# Altium schematic sheet Stepper_Driver_Quark.SchDoc: RP2040 CNC
size B; Author: AM; CompanyName: Expatria Technologies; DrawnBy: A.Marles; Engineer: AM; Organization: Expatria Technolgoies; Address1: 1136 Glade Court; Address3: Port Coquitlam, BC V3B 1R5; Address4: Canada; DocumentNumber: 12; SheetNumber: 12; SheetTotal: 30
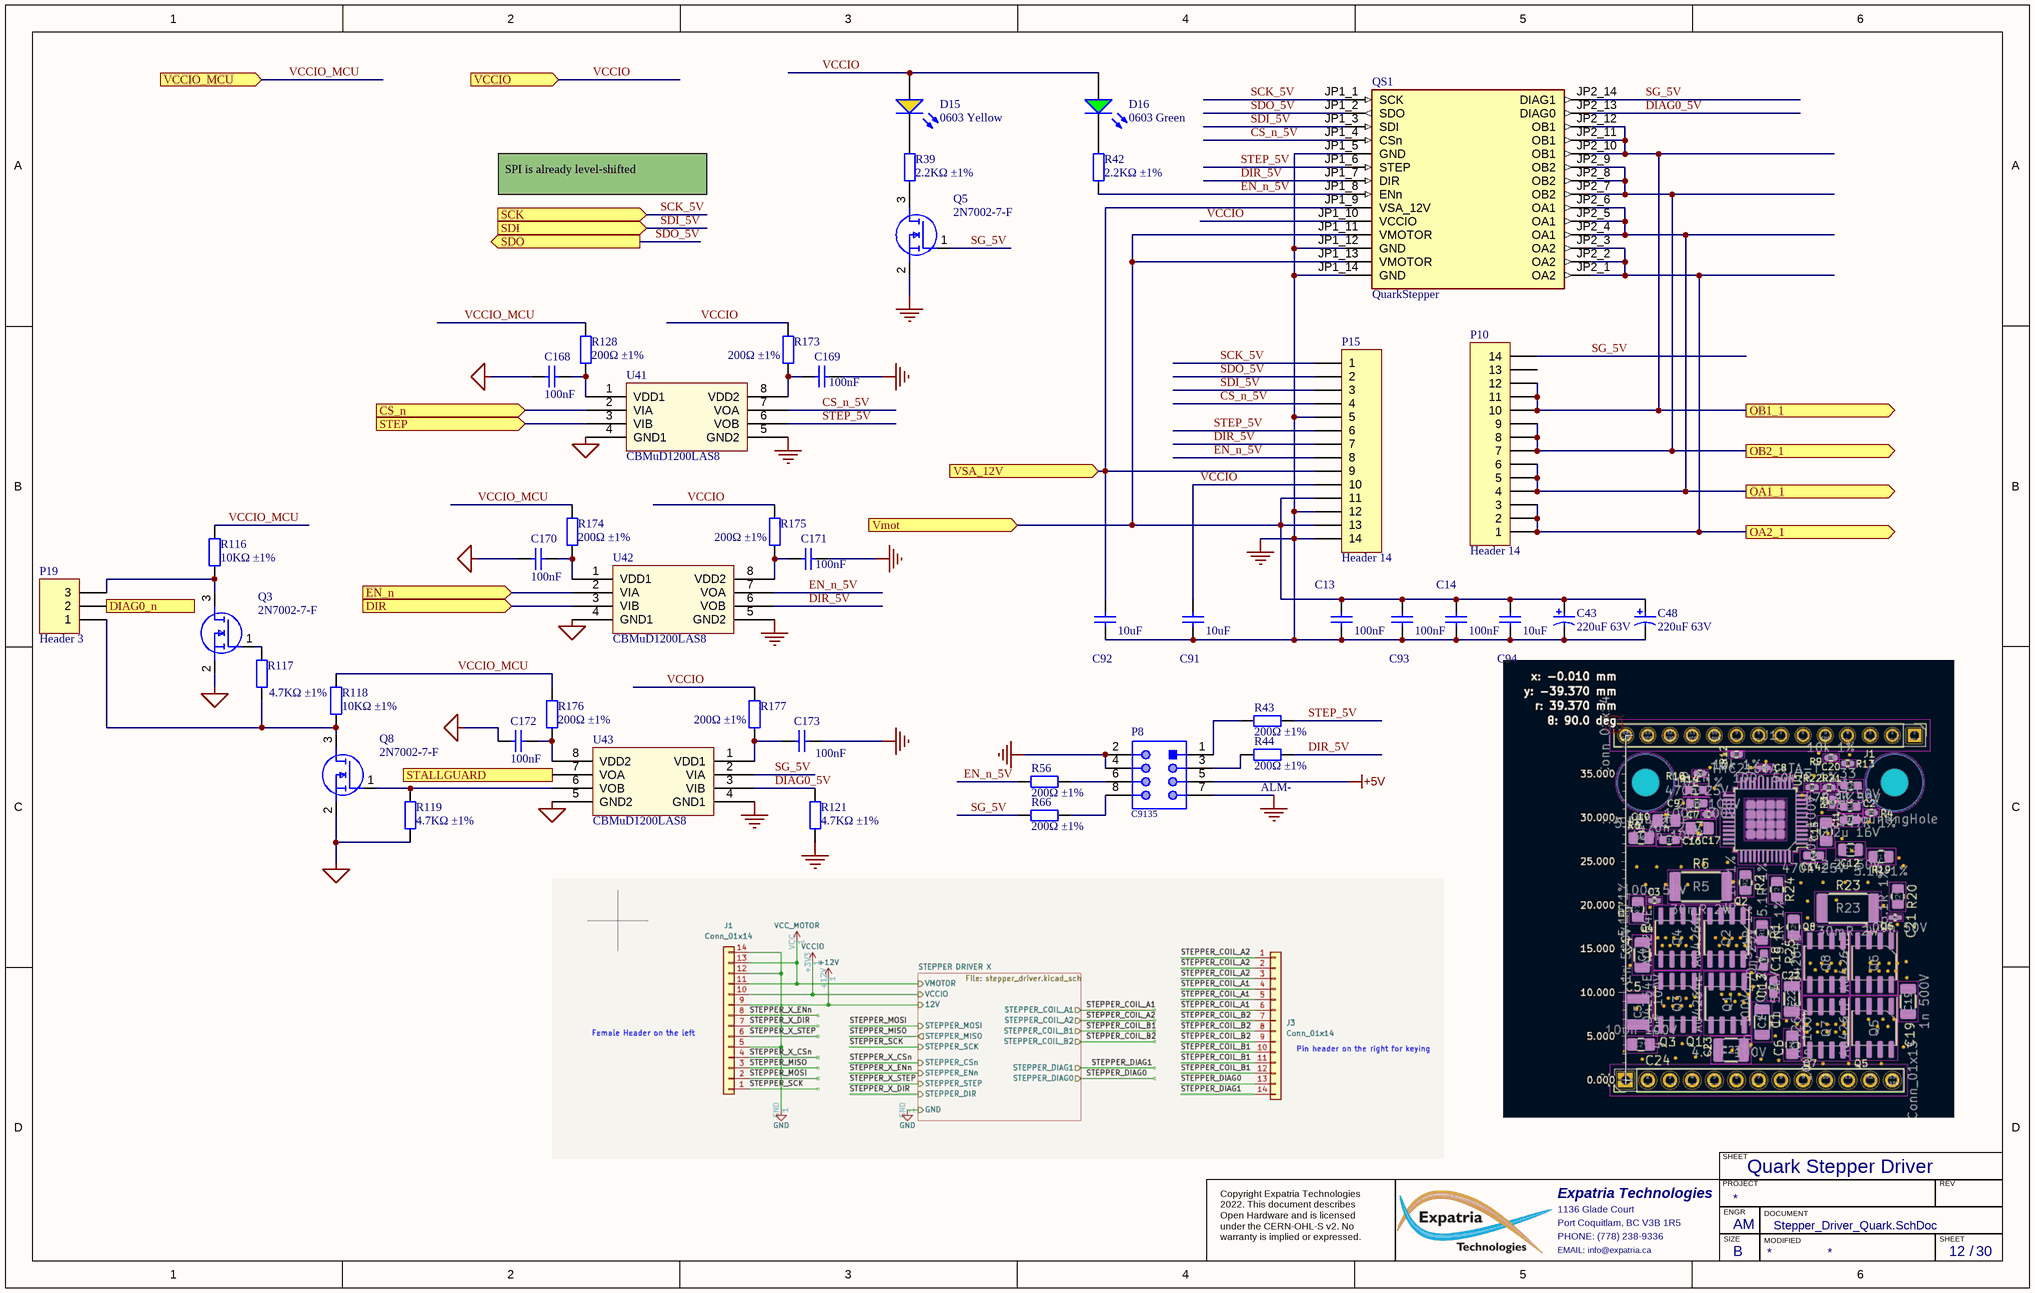
[diagram p0: Stepper_Driver_Quark.SchDoc]

## Parts
C13  100nF  [0603_C]
C14  100nF  [0603_C]
C43  220uF 63V  [PNSC-FK-V-H13_V]
C48  220uF 63V  [PNSC-FK-V-H13_V]
C91  10uF  [0805_C]
C92  10uF  [0805_C]
C93  100nF  [0603_C]
C94  10uF  [0805_C]
C168  100nF  [0603_C]
C169  100nF  [0603_C]
C170  100nF  [0603_C]
C171  100nF  [0603_C]
C172  100nF  [0603_C]
C173  100nF  [0603_C]
D15  0603 Yellow  [0603_LED_S1]
D16  0603 Green  [0603_LED_S1]
P8  C9135  [61200821621]
P10  Header 14  [HDR1X14]
P15  Header 14  [HDR1X14]
P19  Header 3  [HDR1X3]
Q3  2N7002-7-F  [SOT-23(SOT-23-3)]
Q5  2N7002-7-F  [SOT-23(SOT-23-3)]
Q8  2N7002-7-F  [SOT-23(SOT-23-3)]
QS1  QuarkStepper  [QuarkStepperDriver]
R39  2.2KΩ ±1%  [0603_R]
R42  2.2KΩ ±1%  [0603_R]
R43  200Ω ±1%  [0603_R]
R44  200Ω ±1%  [0603_R]
R56  200Ω ±1%  [0603_R]
R66  200Ω ±1%  [0603_R]
R116  10KΩ ±1%  [0603_R]
R117  4.7KΩ ±1%  [0603_R]
R118  10KΩ ±1%  [0603_R]
R119  4.7KΩ ±1%  [0603_R]
R121  4.7KΩ ±1%  [0603_R]
R128  200Ω ±1%  [0603_R]
R173  200Ω ±1%  [0603_R]
R174  200Ω ±1%  [0603_R]
R175  200Ω ±1%  [0603_R]
R176  200Ω ±1%  [0603_R]
R177  200Ω ±1%  [0603_R]
U41  CBMuD1200LAS8  [SOIC-8_150mil]
U42  CBMuD1200LAS8  [SOIC-8_150mil]
U43  CBMuD1200LAS8  [SOIC-8_150mil]

## Ports
CS_n (in), DIAG0_n (out), DIR (in), EN_n (in), OA1_1 (out), OA2_1 (out), OB1_1 (out), OB2_1 (out), SCK (in), SDI (in), SDO (out), STALLGUARD (out), STEP (in), VCCIO (in), VCCIO_MCU (in), Vmot (in), VSA_12V (in)

## Nets
+5V: P8.5
GND: C13.2 C14.2 C43.2 C48.2 C91.1 C92.1 C93.2 C94.1 C169.1 C171.1 C173.2 P8.2 P8.4 P8.7 P15.5 P15.12 P15.14 Q5.2(S) QS1.JP1_5(GND) QS1.JP1_12(GND) QS1.JP1_14(GND) R121.1 U41.5(GND2) U42.5(GND2) U43.4(GND1)
MCU_GND: C168.2 C170.2 C172.1 Q3.2(S) Q8.2(S) R119.1 U41.4(GND1) U42.4(GND1) U43.5(GND2)
CS_n: U41.2(VIA) ; port CS_n
CS_n_5V: P15.4 QS1.JP1_4(CSn) U41.7(VOA)
DIAG0_5V: QS1.JP2_13(DIAG0) R121.2 U43.3(VIB)
DIAG0_n: P19.2 ; port DIAG0_n
DIR: U42.3(VIB) ; port DIR
DIR_5V: P15.7 QS1.JP1_7(DIR) R44.1 U42.6(VOB)
EN_n: U42.2(VIA) ; port EN_n
EN_n_5V: P15.8 QS1.JP1_8(ENn) R42.1 R56.2 U42.7(VOA)
OA1_1: P10.4 P10.5 P10.6 QS1.JP2_4(OA1) QS1.JP2_5(OA1) QS1.JP2_6(OA1) ; port OA1_1
OA2_1: P10.1 P10.2 P10.3 QS1.JP2_1(OA2) QS1.JP2_2(OA2) QS1.JP2_3(OA2) ; port OA2_1
OB1_1: P10.10 P10.11 P10.12 QS1.JP2_10(OB1) QS1.JP2_11(OB1) QS1.JP2_12(OB1) ; port OB1_1
OB2_1: P10.7 P10.8 P10.9 QS1.JP2_7(OB2) QS1.JP2_8(OB2) QS1.JP2_9(OB2) ; port OB2_1
SCK_5V: P15.1 QS1.JP1_1(SCK) ; port SCK
SDI_5V: P15.3 QS1.JP1_3(SDI) ; port SDI
SDO_5V: P15.2 QS1.JP1_2(SDO) ; port SDO
SG_5V: P10.14 Q5.1(G) QS1.JP2_14(DIAG1) R66.2 U43.2(VIA)
STALLGUARD: U43.7(VOA) ; port STALLGUARD
STEP: U41.3(VIB) ; port STEP
STEP_5V: P15.6 QS1.JP1_6(STEP) R43.1 U41.6(VOB)
VCCIO: C91.2 D15.A D16.A P15.10 QS1.JP1_10(VCCIO) R173.2 R175.2 R177.2 ; port VCCIO
VCCIO_MCU: R116.2 R118.2 R128.2 R174.2 R176.2 ; port VCCIO_MCU
Vmot: C13.1 C14.1 C43.1 C48.1 C93.1 C94.2 P15.11 P15.13 QS1.JP1_11(VMOTOR) QS1.JP1_13(VMOTOR) ; port Vmot
VSA_12V: C92.2 P15.9 QS1.JP1_9(VSA_12V) ; port VSA_12V
NetC168_1: C168.1 R128.1 U41.1(VDD1)
NetC169_2: C169.2 R173.1 U41.8(VDD2)
NetC170_1: C170.1 R174.1 U42.1(VDD1)
NetC171_2: C171.2 R175.1 U42.8(VDD2)
NetC172_2: C172.2 R176.1 U43.8(VDD2)
NetC173_1: C173.1 R177.1 U43.1(VDD1)
NetD15_K: D15.K R39.2
NetD16_K: D16.K R42.2
NetP8_1: P8.1 R43.2
NetP8_3: P8.3 R44.2
NetP8_6: P8.6 R56.1
NetP8_8: P8.8 R66.1
NetP19_1: P19.1 Q8.3(D) R117.1 R118.1
NetP19_3: P19.3 Q3.3(D) R116.1
NetQ3_1: Q3.1(G) R117.2
NetQ5_3: Q5.3(D) R39.1
NetQ8_1: Q8.1(G) R119.2 U43.6(VOB)

Not connected (* = marked no-connect by the designer): P10 13

## Notes on the sheet
- SPI is already level-shifted
- (near R44) ALM-
- Quark Stepper Driver
- SHEET
- Expatria Technologies
- 1136 Glade Court
- Port Coquitlam, BC V3B 1R5
- PHONE: (778) 238-9336
- PROJECT
- SIZE
- ENGR
- MODIFIED
- DOCUMENT
- REV
- Copyright Expatria Technologies 2022. This document describes Open Hardware and is licensed under the CERN-OHL-S v2. No warranty is implied or expressed.
- EMAIL: info@expatria.ca
- B
- /

## Library data of the parts
C13 C14 C93 = 0603 100nF (104) 10% 50V: Chip capacitors; Manufacturer: YAGEO; Manufacturer Part Number: CC0603KRX7R9BB104; Tolerance: 10%; Voltage: 50V; ComponentLink1Description: Supplier link; ComponentLink1URL: http://www.szlcsc.com/product/details_15331.html; Package: 0603; Supplier: LCSC; SuppliersPartNumber: C14663; Capacitance: 100nF
C43 C48 = CMP-2000-06222-1: Aluminum Electrolytic Capacitor, 220 uF, +/- 20%, 63 V, 2-Pin SMD (Size Code H13), -55 to 105 degC, RoHS, Tape and Reel; Manufacturer: Panasonic; Impedance: 0.16ohm; Life Time @ Temperature: 2000hours@105°C; Product Range: PANASONIC-?????FK; External Length / Height: 13.5mm; Ripple Current Temperature: 105°C; Ripple Current Frequency: 100kHz; Ripple Current AC: 800mA; Power Factor: 0.08; Power Factor Frequency: 120Hz; AE Capacitor Case: RadialCan-SMD; Capacitance: 220µF; Operating Lifetime: 2000h; SVHC: NoSVHC(16-Dec-2013); Diameter: 12.5mm; Voltage Rating: 63V; Package Description: 2-Pin Electrolytic Aluminum Capacitor, Body 13.5 x 13.5 mm; Height: 13.5mm; Package URL: http://industrial.panasonic.com/cdbs/www-data/pdf/RDE0000/DME0000COL48.pdf; Lifetime @ Temperature: 2000hours@105°C; Series: FK; Mounting Technology: SurfaceMount; Datasheet Version: 03/2016; Package / Case: H13; Voltage Rating V DC: 63V; Capacitance Tolerance ±: ±20%; Tolerance +: 20%; Capacitance Tolerance: ±20%; Package Reference: FK-V-H13; Datasheet URL: https://industrial.panasonic.com/cdbs/www-data/pdf/RDE0000/ABA0000C1181.pdf; Operating Temperature Range: -55°Cto+105°C; Manufacturer URL: http://www.panasonic.com/; Operating Temperature Min: -55°C; Capacitor Terminals: SMD; Packaging: CutTape; Operating Temperature Max: 105°C; Tolerance -: 20%; Operating life Time: 2000h; Capacitor Case Style: SMD
C91 C92 C94 = 0805 10uF (106) 10% 25V: Chip capacitors; Manufacturer: Samsung Electro-Mechanics; PartNumber: CL21A106KAYNNNE; Tolerance: 10%; Voltage: 25V; ComponentLink1Description: Supplier link; ComponentLink1URL: http://www.szlcsc.com/product/details_16532.html; Package: 0805; Supplier: LCSC; SuppliersPartNumber: C15850; Capacitance: 10uF; Manufacturer Part Number: CL21A106KAYNNNE
C168-C173 = 0603 100nF (104) 10% 50V: Chip capacitors; Manufacturer: YAGEO; PartNumber: CC0603KRX7R9BB104; Tolerance: 10%; Voltage: 50V; ComponentLink1Description: Supplier link; ComponentLink1URL: http://www.szlcsc.com/product/details_15331.html; Package: 0603; Supplier: LC; SuppliersPartNumber: C14663; Capacitance: 100nF
D15 = 0603 LED Yellow: LED; ComponentLink1Description: 供应商链接; ComponentLink1URL: http://www.szlcsc.com/product/details_73147.html; Package: 0603; Supplier: LC; SuppliersPartNumber: C72038; Color: Yellow
D16 = 0603 LED Green: LED; ComponentLink1Description: 供应商链接; ComponentLink1URL: http://www.szlcsc.com/product/details_73152.html; Package: 0603; Supplier: LC; SuppliersPartNumber: C72043; Color: Green
P8 = CMP-1502-00006-1: Male Box Header WR-BHD, THT, Vertical, pitch 2.54 mm, 8 pins; Manufacturer: Wurth Elektronik; Pitch: 2.54mm; Publisher: WurthElektronik; Part Number: C9135; Packaging: Tray; Published Date: August2018; Package Reference: 61200821621; SuppliersPartNumber: C9135
P10 = Header 14: Header, 14-Pin; LatestRevisionDate: 17-Jul-2002; LatestRevisionNote: Re-released for DXP Platform.; Publisher: Altium Limited; SuppliersPartNumber: C2894937
P15 = Header 14: Socket, 14-Pin; LatestRevisionDate: 17-Jul-2002; LatestRevisionNote: Re-released for DXP Platform.; Publisher: Altium Limited; SuppliersPartNumber: C2897377
P19 = Header 3: Header, 3-Pin; Publisher: Altium Limited; SuppliersPartNumber: C49257
Q3 Q5 Q8 = 2N7002-7-F: 60V 115mA 7.5Ω@5V,50mA 370mW N Channel SOT-23 MOSFETs ROHS; Manufacturer: Diodes Inc.; SuppliersPartNumber: C85049; Manufacturer Part Number: 2N7002-7-F; Value: 2N7002-7-F; Datasheet Link: https://datasheet.datasheetarchive.com/originals/distributors/SFDatasheet-0/sf-0003625.pdf; Height: 1.2mm; Manufacturer_Part_Number: 2N7002-7-F; Mouser Part Number: 621-2N7002-F; Mouser Price/Stock: https://www.mouser.co.uk/ProductDetail/Diodes-Incorporated/2N7002-7-F?qs=jMXWnm70%252BC%252BAX%252BMLzUkTZg%3D%3D; Arrow Part Number: 2N7002-7-F; Arrow Price/Stock: https://www.arrow.com/en/products/2n7002-7-f/diodes-incorporated?region=nac
QS1 = Quark_2160: Open source TMC2160 module; MF: Trinamic Motion; MP: TMC2208 SILENTSTEPSTICK; Digi-Key_Part_Number: 1460-TMC2208SILENTSTEPSTICK-ND; SnapEDA_Link: https://www.snapeda.com/parts/TMC2208%20SILENTSTEPSTICK/Trinamic+Motion+Control+GmbH/view-part/?ref=snap; Purchase-URL: https://pricing.snapeda.com/search/part/TMC2208 SILENTSTEPSTICK/?ref=eda; Package: None; Check_prices: https://www.snapeda.com/parts/TMC2208%20SILENTSTEPSTICK/Trinamic+Motion+Control+GmbH/view-part/?ref=eda; Value: *
R39 R42 = 0603 2.2K (2201) 1%: Chip resistor; Manufacturer: Uniroyal Elec; PartNumber: 0603WAF2201T5E; Power: 1/10W; ComponentLink1Description: Supplier link; ComponentLink1URL: http://www.szlcsc.com/product/details_4597.html; Package: 0603; Supplier: LC; SuppliersPartNumber: C4190; Resistance: 2.2KΩ; Tolerance: 1%
R43 R44 R56 R66 R128 R173-R177 = 0603 200R (2000) 1%: Chip resistor; Manufacturer: Uniroyal Elec; PartNumber: 0603WAF2000T5E; Power: 1/10W; ComponentLink1Description: Supplier link; ComponentLink1URL: http://www.szlcsc.com/product/details_8708.html; Package: 0603; Supplier: LC; SuppliersPartNumber: C8218; Resistance: 200Ω; Tolerance: 1%
R116 R118 = 0603 10K (1002) 1%: Chip resistor; Manufacturer: Uniroyal Elec; PartNumber: 0603WAF1002T5E; Power: 1/10W; ComponentLink1Description: Supplier link; ComponentLink1URL: http://www.szlcsc.com/product/details_26547.html; Package: 0603; Supplier: LC; SuppliersPartNumber: C25804; Resistance: 10KΩ; Tolerance: 1%
R117 R119 R121 = 0603 4.7K (4701) 1%: Chip resistor; Manufacturer: Uniroyal Elec; PartNumber: 0603WAF4701T5E; Power: 1/10W; ComponentLink1Description: Supplier link; ComponentLink1URL: http://www.szlcsc.com/product/details_23889.html; Package: 0603; Supplier: LC; SuppliersPartNumber: C23162; Resistance: 4.7KΩ; Tolerance: 1%
U41-U43 = CBMuD1200LAS8: Dual Channel Isolator; Package: SOIC-8_150mil; Supplier: LC; SuppliersPartNumber: C476470; ComponentLink1Description: 供应商链接; ComponentLink1URL: http://www.szlcsc.com/product/details_10199.html